# EAGLE schematic SparkFun_Si4703_Eval_Board (EAGLE 7.2.0)
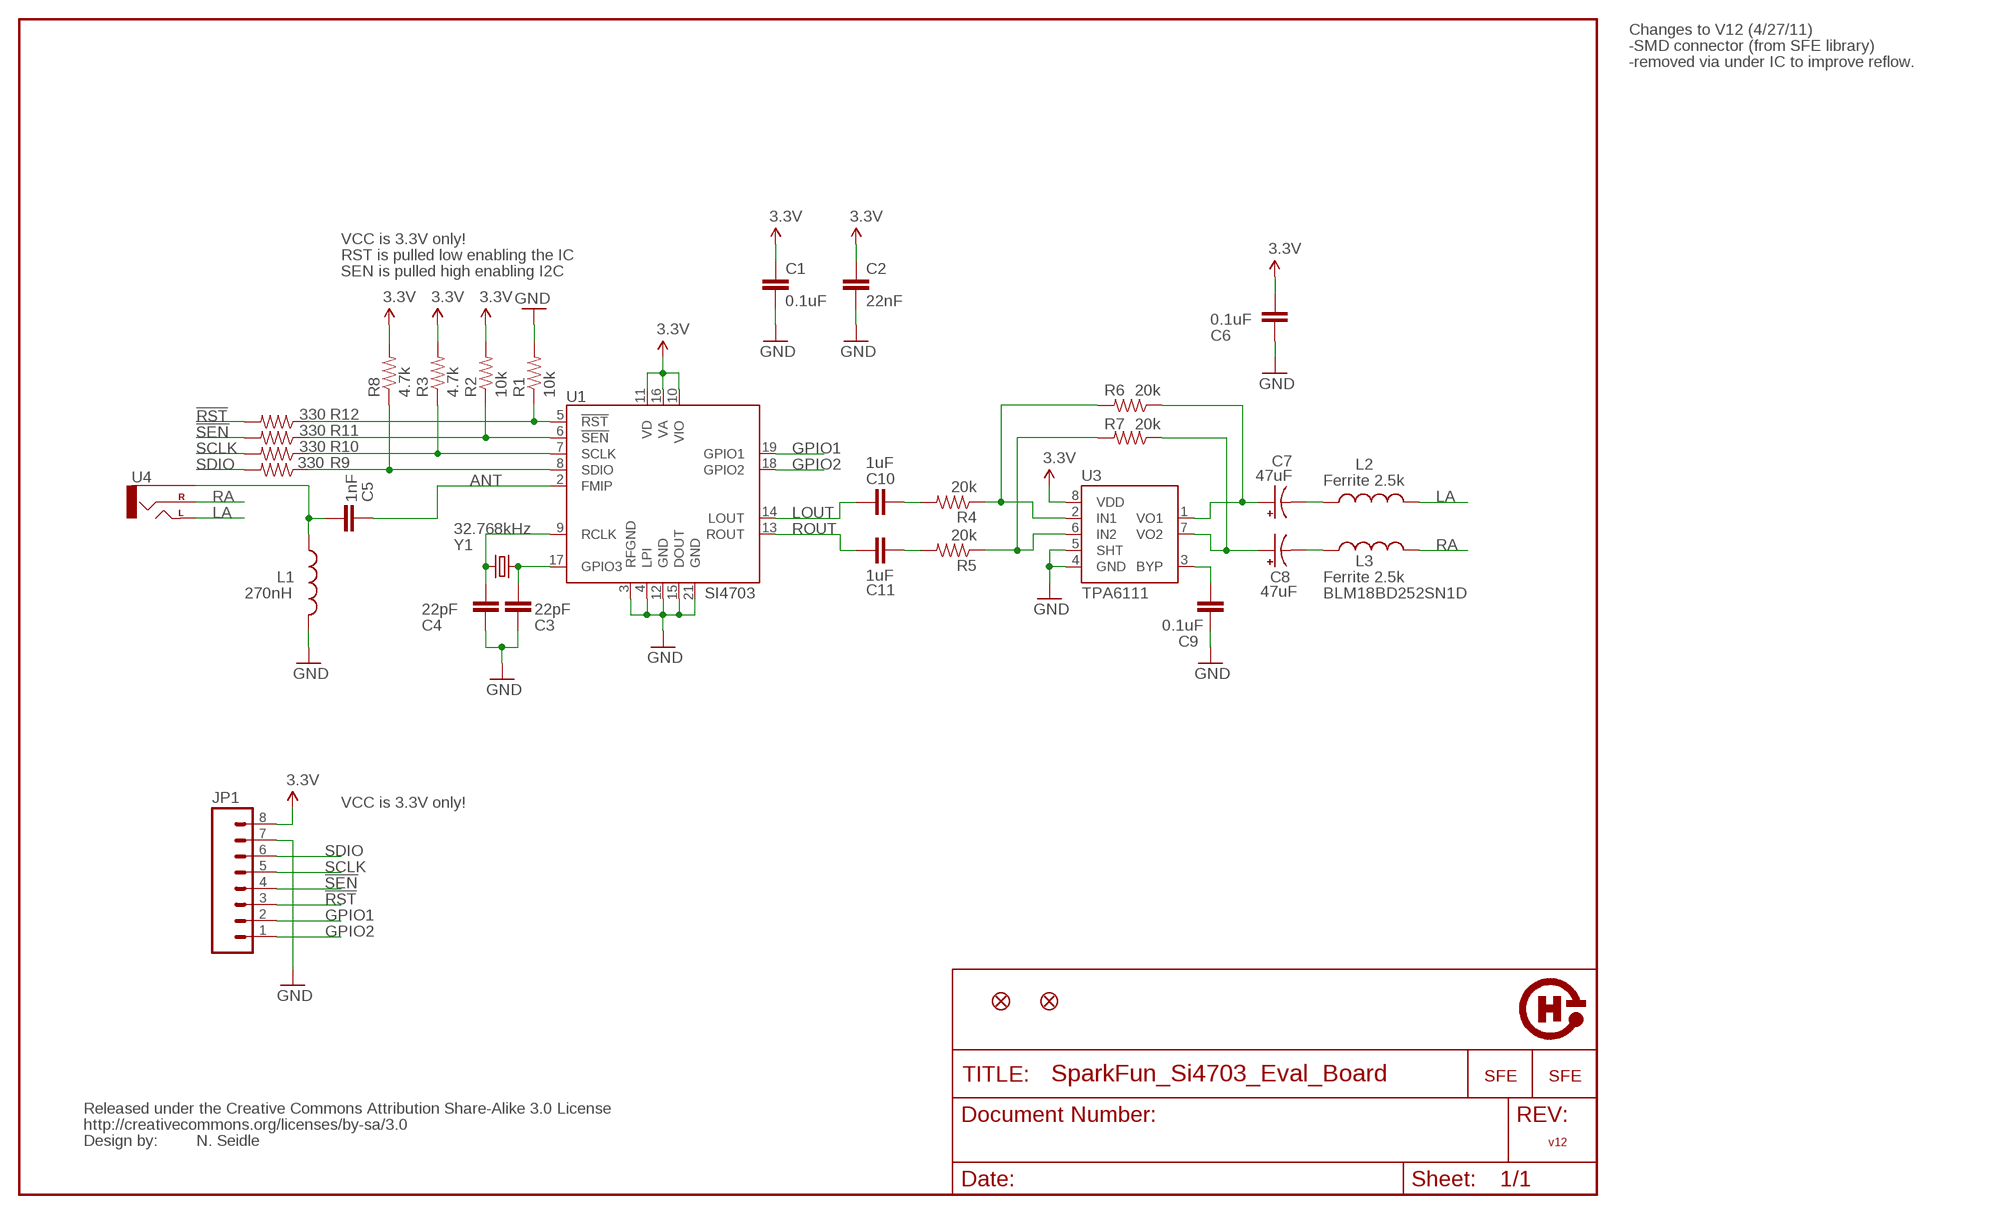
[diagram p0: schematic, sheet 1]

## Parts
C1  0.1uF  CAP0402-CAP  [0402-CAP]
C2  22nF  CAP0402-CAP  [0402-CAP]
C3  22pF  CAP0402-CAP  [0402-CAP]
C4  22pF  CAP0402-CAP  [0402-CAP]
C5  1nF  CAP0402-CAP  [0402-CAP]
C6  0.1uF  CAP0402-CAP  [0402-CAP]
C7  47uF  CAP_POL3528  [EIA3528]
C8  47uF  CAP_POL3528  [EIA3528]
C9  0.1uF  CAP0402-CAP  [0402-CAP]
C10  1uF  CAP0402-CAP  [0402-CAP]
C11  1uF  CAP0402-CAP  [0402-CAP]
JP1  M08  [1X08]
JP2  LOGO-SFENEW  [SFE-NEW-WEBLOGO]
JP3  LOGO-SFESK  [SFE-LOGO-FLAME]
JP4  FIDUCIAL1X2  [FIDUCIAL-1X2]
JP5  FIDUCIAL1X2  [FIDUCIAL-1X2]
L1  270nH  INDUCTOR0402  [C0402]
L2  Ferrite 2.5k  INDUCTOR0402  [C0402]
L3  Ferrite 2.5k  INDUCTOR0402  [C0402]
R1  10k  RESISTOR0402-RES  [0402-RES]
R2  10k  RESISTOR0402-RES  [0402-RES]
R3  4.7k  RESISTOR0402-RES  [0402-RES]
R4  20k  RESISTOR0402-RES  [0402-RES]
R5  20k  RESISTOR0402-RES  [0402-RES]
R6  20k  RESISTOR0402-RES  [0402-RES]
R7  20k  RESISTOR0402-RES  [0402-RES]
R8  4.7k  RESISTOR0402-RES  [0402-RES]
R9  330  RESISTOR0402-RES  [0402-RES]
R10  330  RESISTOR0402-RES  [0402-RES]
R11  330  RESISTOR0402-RES  [0402-RES]
R12  330  RESISTOR0402-RES  [0402-RES]
U1  SI4703  SI470X  [SI470X]
U3  TPA6111  TPA6111SMD  [SO08]
U4  AUDIO-JACKSMD2  [AUDIO-JACK-3.5MM-SMD]
U$1  CREATIVE_COMMONS  [CREATIVE_COMMONS]
U$2  OSHW-LOGO  [OSHW-LOGO]
Y1  32.768kHz  CRYSTAL32-SMD  [CRYSTAL-32KHZ-SMD]

## Nets
3.3V: C1.1 C2.1 C6.2 JP1.8 R2.2 R3.2 R8.2 U1.10(VIO) U1.11(VD) U1.16(VA) U3.8(VDD)
!RST: JP1.3 R12.2
!RST-L: R1.1 R12.1 U1.5(!RST)
!SEN: JP1.4 R11.2
!SEN-L: R2.1 R11.1 U1.6(!SEN)
ANT: C5.1 U1.2(FMIP)
GND: C1.2 C2.2 C3.1 C4.1 C6.1 C9.2 JP1.7 L1.2 R1.2 U1.3(RFGND) U1.4(LPI) U1.12(GND) U1.15(DOUT) U1.21(GND) U3.4(GND) U3.5(SHT)
GPIO1: JP1.2 U1.19(GPIO1)
GPIO2: JP1.1 U1.18(GPIO2)
LA: L2.2 U4.TIP(LEFT)
LOUT: C10.1 U1.14(LOUT)
N$1: C4.2 U1.9(RCLK) Y1.X2
N$2: C3.2 U1.17(GPIO3) Y1.X1
N$3: C5.2 L1.1 U4.SLEEVE
N$4: C7.C(-) L2.1
N$5: C7.A(+) R6.1 U3.1(VO1)
N$6: C8.A(+) R7.1 U3.7(VO2)
N$7: C8.C(-) L3.1
N$8: C9.1 U3.3(BYP)
N$11: R4.1 R6.2 U3.2(IN1)
N$12: R5.1 R7.2 U3.6(IN2)
N$13: C10.2 R4.2
N$14: C11.2 R5.2
RA: L3.2 U4.RING(RIGHT)
ROUT: C11.1 U1.13(ROUT)
SCLK: JP1.5 R10.2
SCLK-L: R3.1 R10.1 U1.7(SCLK)
SDIO: JP1.6 R9.2
SDIO-L: R8.1 R9.1 U1.8(SDIO)

## Notes on the sheet
- Changes to V12 (4/27/11)
- -SMD connector (from SFE library)
- -removed via under IC to improve reflow.
- VCC is 3.3V only!
- RST is pulled low enabling the IC
- SEN is pulled high enabling I2C
- BLM18BD252SN1D
- VCC is 3.3V only!
- N. Seidle | v12

## Library data of the parts
C1-C6 C9-C11 = SparkFun:CAP: Capacitor Standard 0603 ceramic capacitor, and 0.1" leaded capacitor.
C7 C8 = SparkFun:CAP_POL: Capacitor Polarized These are standard SMD and PTH capacitors. Normally 10uF, 47uF, and 100uF in electrolytic and tantalum varieties. Always verify the external diameter of the through hole cap, it varies with capacity, voltage, and manufacturer. The EIA devices should be standard.
JP1 = SparkFun:M08: Header 8 Standard 8-pin 0.1" header. Use with straight break away headers (SKU : PRT-00116), right angle break away headers (PRT-00553), swiss pins (PRT-00743), machine pins (PRT-00117), and female headers (PRT-00115).
JP2 JP3 = SparkFun:LOGO-SFE: Spark Fun Electronics PCB Logo This is the standard Spark Fun Electronics PCB logo.
JP4 JP5 = SparkFun:FIDUCIAL: Fiducial Alignment Points Various fiducial points for machine vision alignment.
L1-L3 = SparkFun:INDUCTOR: Inductors Basic Inductor/Choke - 0603 and 1206. Footprints are not proven and vary greatly between part numbers.
R1-R12 = SparkFun:RESISTOR: Resistor Basic schematic elements and footprints for 0603, 1206, and PTH 1/10th watt (small) resistors.
U1 = SparkFun:SI470X
U3 = SparkFun:TPA6111
U4 = SparkFun:AUDIO-JACK: 3.5mm Audio Jack Simple 3.5mm common PCB mount audio jack. SKU: PRT-08032
U$1 = SparkFun:CREATIVE_COMMONS
U$2 = OSHW:OSHW-LOGO
Y1 = SparkFun:CRYSTAL: Crystals Various standard crystals. Proven footprints. Spark Fun Electronics SKU : COM-00534